# EAGLE design MiP_Proto-Pack (EAGLE 6.5.0)
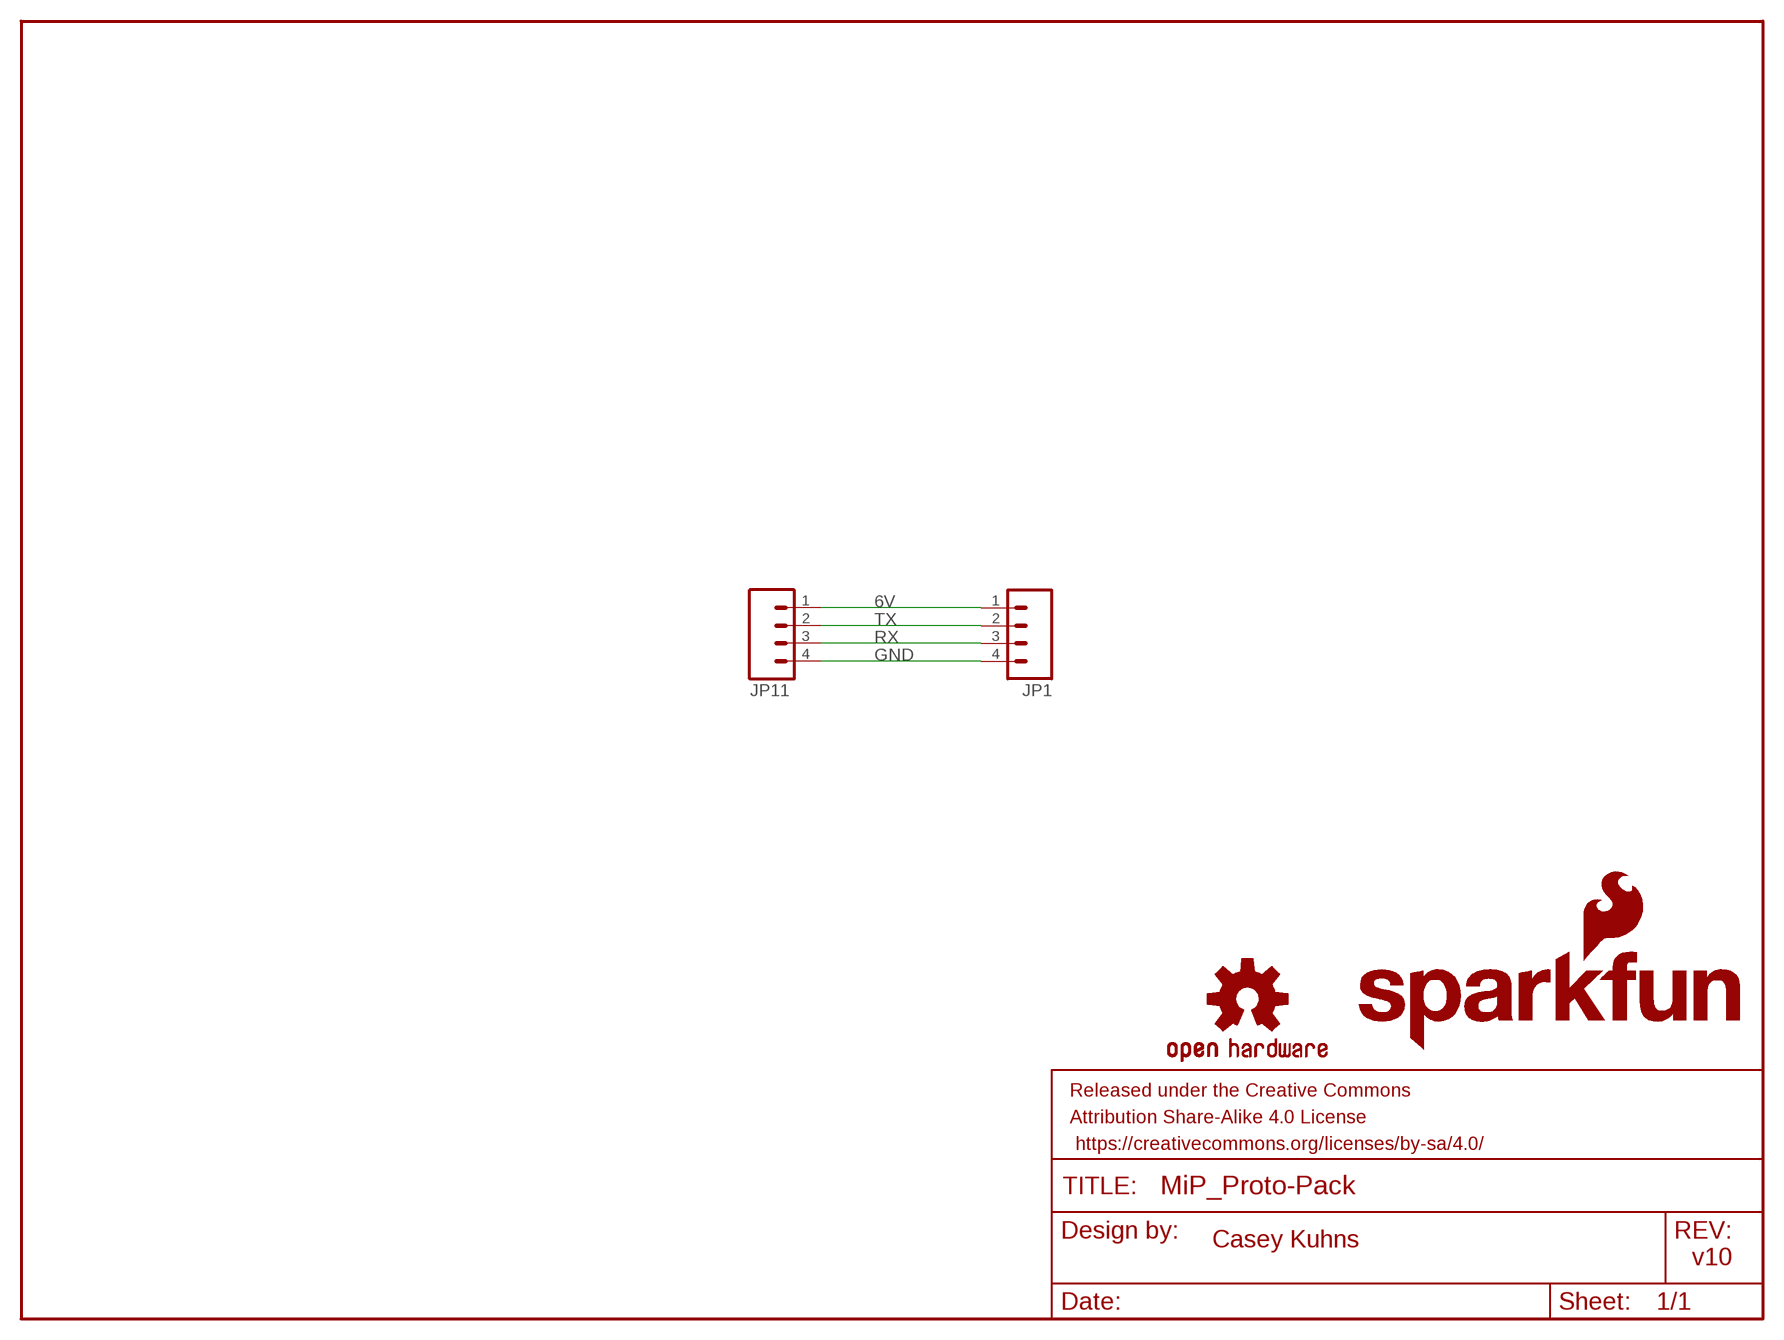
[diagram p0: schematic, sheet 1]

## Parts
FRAME1  FRAME-LETTER  [CREATIVE_COMMONS]
JP1  M04PTH  [1X04]
JP11  M04JST  [1X04-1.5MM_JST]
LOGO1  SFE_LOGO_NAME_FLAME.1_INCH  [SFE_LOGO_NAME_FLAME_.1]
LOGO2  OSHW-LOGOS  [OSHW-LOGO-S]

## Nets
6V: JP1.1 JP11.1
GND: JP1.4 JP11.4
RX: JP1.3 JP11.3
TX: JP1.2 JP11.2

## Notes on the sheet
- Casey Kuhns
- v10

## Library data of the parts
FRAME1 = SparkFun-Aesthetics:FRAME-LETTER: Schematic Frame Standard 8.5x11 US Letter frame
JP1 JP11 = SparkFun-Connectors:M04: Header 4 Standard 4-pin 0.1" header. Use with straight break away headers (SKU : PRT-00116), right angle break away headers (PRT-00553), swiss pins (PRT-00743), machine pins (PRT-00117), and female headers (PRT-00115). Molex polarized connector foot print use with SKU : PRT-08231 with associated crimp pins and housings. 1MM SMD Version SKU: PRT-10208
LOGO1 = SparkFun-Aesthetics:SFE_LOGO_NAME_FLAME: SFE Logo, name and flame This is the SparkFun full logo. The logo on the schematic will always be the same size; the package variant is the height of the flame part of the logo. Default layer for the logo on the board is tSilk.
LOGO2 = SparkFun-Aesthetics:OSHW-LOGO: Open Source Hardware Logo This logo indicates the piece of hardware it is found on incorporates a OSHW license and/or adheres to the definition of open source hardware found here: http://freedomdefined.org/OSHW

## Net classes
0 default: width 0.203 mm
1 vcc: width 0.254 mm

## Board
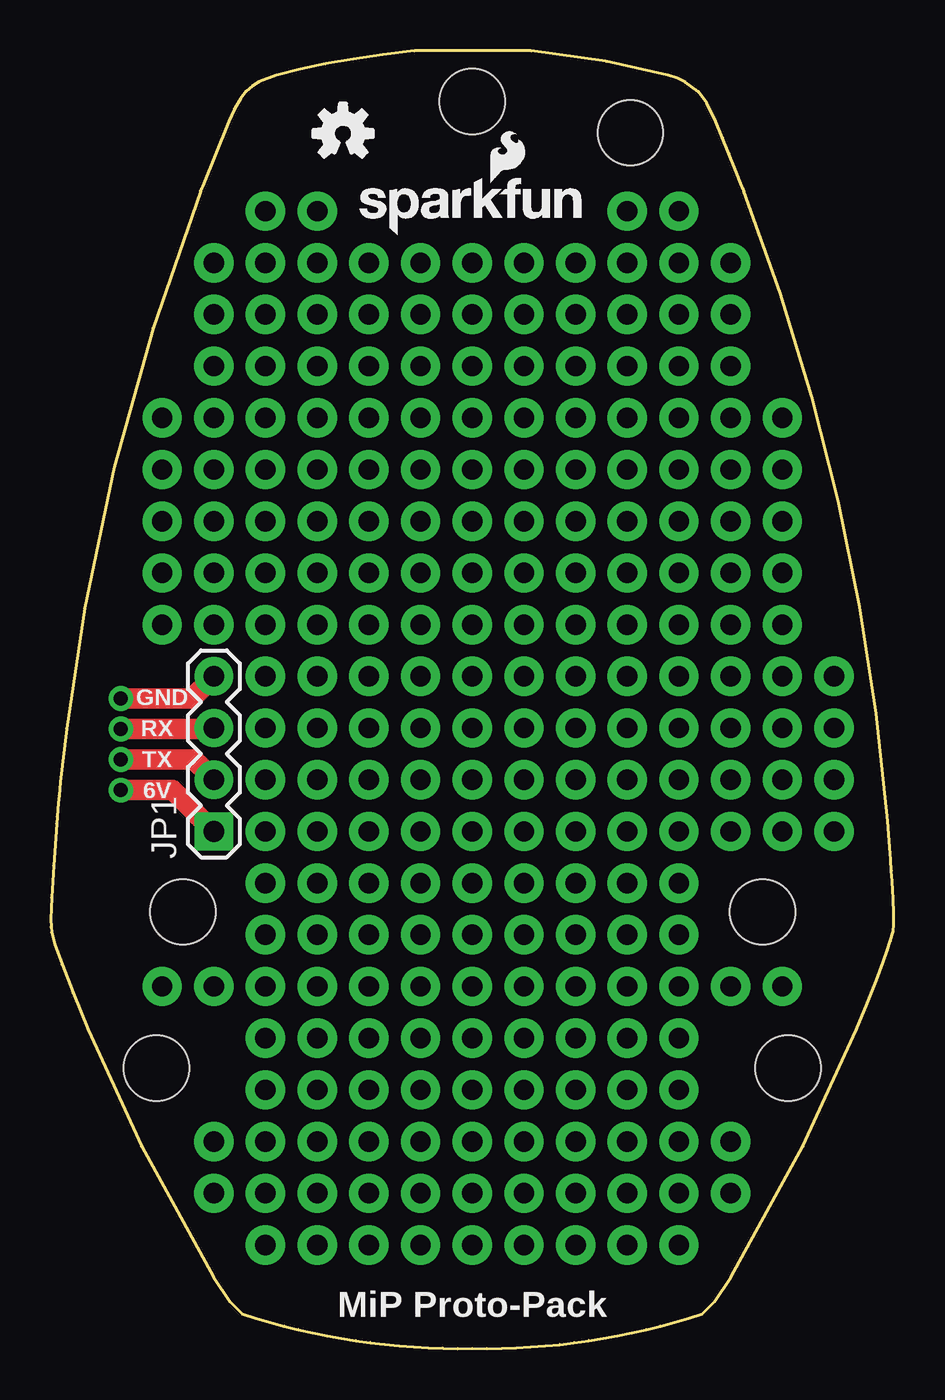
[diagram p1: board, top side]
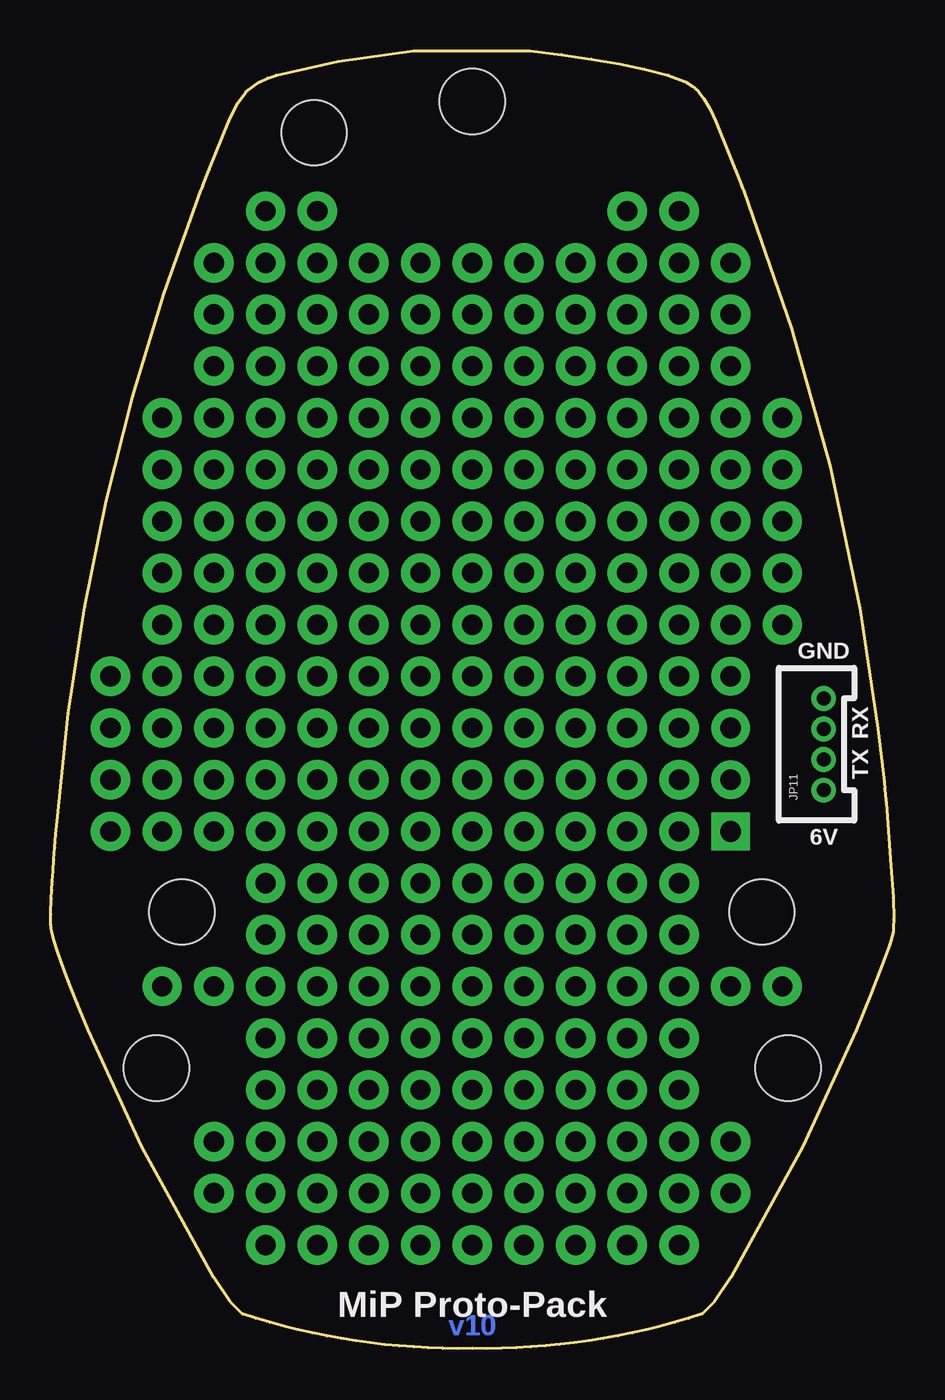
[diagram p2: board, bottom side, seen from below]

Size 41.42 x 63.77 mm. Coordinates in mm from the lower left corner, seen from the top.
Outline: 16.32,63.59 14.86,63.37 13.5,63.13 12.25,62.87 11.09,62.58 10.24,62.25 9.89,62.03 9.6,61.78 9.32,61.43 9.03,60.94 8.74,60.3 7.46,57.12 7.46,57.1 7.45,57.09 7.44,57.07 7.44,57.06 7.43,57.04 7.42,57.03 7.42,57.01 7.41,57 7.4,56.98 7.4,56.97 7.39,56.96 7.38,56.94 7.37,56.93 7.36,56.91 7.36,56.9 7.35,56.88 5.02,50.15 3.12,43.32 1.66,36.38 0.77,30.47 0.47,27.85 0.44,27.51 0.4,27.17 0.37,26.82 0.31,26.14 0.28,25.79 0.13,23.74 0.03,22.17 0,21.08 0.01,20.71 0.03,20.47 0.2,19.87 0.55,18.87 1.09,17.47 1.83,15.67 4.46,9.93 8.01,3.51 8.82,2.29 9.4,1.71 10.08,1.49 10.77,1.29 11.47,1.1 12.16,0.93 12.86,0.77 13.57,0.63 14.27,0.5 14.98,0.39 15.69,0.29 16.41,0.21 17.12,0.14 17.84,0.08 18.56,0.04 19.27,0.02 19.99,0 20.71,0.01 21.43,0 22.15,0.01 22.86,0.04 23.58,0.08 24.3,0.13 25.01,0.2 25.72,0.29 26.44,0.39 27.15,0.5 27.85,0.63 28.56,0.77 29.26,0.93 29.95,1.1 30.65,1.29 31.34,1.49 32.02,1.71 32.6,2.29 33.41,3.51 36.96,9.93 39.59,15.67 40.12,16.97 40.56,18.08 40.91,19 41.11,19.57 41.26,20.03 41.39,20.5 41.42,20.84 41.42,21.36 41.4,22.11 41.37,22.52 41.35,22.98 41.31,23.48 41.27,24.03 41.23,24.62 41.18,25.26 41.12,25.94 40.56,31.21 39.75,36.45 38.69,41.65 37.39,46.79 35.85,51.87 34.07,56.88 34.06,56.9 34.05,56.91 34.05,56.93 34.04,56.94 34.03,56.96 34.02,56.97 34.02,56.98 34.01,57 34,57.01 33.99,57.03 33.99,57.04 33.98,57.06 33.98,57.07 33.97,57.09 33.96,57.1 33.96,57.12 33.64,57.92 33.33,58.72 33.01,59.51 32.68,60.3 32.24,61.2 31.83,61.77 31.18,62.24 30.78,62.43 30.33,62.58 27.28,63.25 23.6,63.77 17.87,63.77 16.32,63.59
Copper layers (1*16): Top 0.035mm / dielectric 1.5mm / Bottom 0.035mm
Design rules "default *": minimum track width 6mil, minimum drill 13mil, track to track 6mil, track to pad 6mil, pad to pad 6mil, via to via 6mil, smd to smd 6mil, copper to edge 8mil, drill to drill 8mil, minimum pad ring 10mil, minimum via ring 8mil, stop-mask expansion 4mil, vias tented up to drill 25mil, thermal gap 8mil
Holes 3.2 mm at 20.71,61.28 28.48,59.76 34.98,21.45 5.19,13.78 36.23,13.78 6.48,21.45

### Footprints (pad centres in the part's own frame; a part is rotated, then mirrored left to right if it is on the bottom)
1X04 = drill 1.016 pad 1.88 square: 1 0,0 | drill 1.016 pad 1.88: 2 2.54,0; 3 5.08,0; 4 7.62,0
1X04-1.5MM_JST = drill 0.7: 1 0,0; 2 1.5,0; 3 3,0; 4 4.5,0

### Placement (x,y rotation side)
FRAME1  9.28,-10.14 0 top  (outside the outline)
JP1  8.01,25.42 90 top
JP11  3.44,27.45 90 bottom
LOGO1  14.74,54.63 0 top
LOGO2  14.36,59.71 0 top

### Tracks (layer width: path | path; a pad name or v marks a point on that pad's centre or on a via)
6V
  Top 1.016: JP11.1 5.98,27.45 JP1.1
GND
  Top 1.016: JP11.4 6.92,31.95 JP1.4
N$5  (via drill 1 pad 1.93)
  other vias: 10.55,33.04
N$6  (via drill 1 pad 1.93)
  other vias: 10.55,30.5
N$7  (via drill 1 pad 1.93)
  other vias: 10.55,27.96
N$8  (via drill 1 pad 1.93)
  other vias: 10.55,25.42
N$9  (via drill 1 pad 1.93)
  other vias: 10.55,22.88
N$10  (via drill 1 pad 1.93)
  other vias: 10.55,20.34
N$11  (via drill 1 pad 1.93)
  other vias: 13.09,20.34
N$12  (via drill 1 pad 1.93)
  other vias: 13.09,22.88
N$13  (via drill 1 pad 1.93)
  other vias: 13.09,25.42
N$15  (via drill 1 pad 1.93)
  other vias: 13.09,27.96
N$16  (via drill 1 pad 1.93)
  other vias: 13.09,30.5
N$17  (via drill 1 pad 1.93)
  other vias: 13.09,33.04
N$18  (via drill 1 pad 1.93)
  other vias: 13.09,35.58
N$19  (via drill 1 pad 1.93)
  other vias: 10.55,35.58
N$20  (via drill 1 pad 1.93)
  other vias: 8.01,35.58
N$21  (via drill 1 pad 1.93)
  other vias: 8.01,38.12
N$22  (via drill 1 pad 1.93)
  other vias: 10.55,38.12
N$23  (via drill 1 pad 1.93)
  other vias: 13.09,38.12
N$24  (via drill 1 pad 1.93)
  other vias: 15.63,38.12
N$25  (via drill 1 pad 1.93)
  other vias: 15.63,35.58
N$26  (via drill 1 pad 1.93)
  other vias: 15.63,33.04
N$27  (via drill 1 pad 1.93)
  other vias: 15.63,30.5
N$28  (via drill 1 pad 1.93)
  other vias: 15.63,27.96
N$29  (via drill 1 pad 1.93)
  other vias: 15.63,25.42
N$30  (via drill 1 pad 1.93)
  other vias: 15.63,22.88
N$31  (via drill 1 pad 1.93)
  other vias: 15.63,20.34
N$32  (via drill 1 pad 1.93)
  other vias: 20.71,20.34
N$33  (via drill 1 pad 1.93)
  other vias: 18.17,20.34
N$34  (via drill 1 pad 1.93)
  other vias: 18.17,22.88
N$35  (via drill 1 pad 1.93)
  other vias: 18.17,25.42
N$36  (via drill 1 pad 1.93)
  other vias: 18.17,27.96
N$37  (via drill 1 pad 1.93)
  other vias: 18.17,30.5
N$38  (via drill 1 pad 1.93)
  other vias: 18.17,33.04
N$39  (via drill 1 pad 1.93)
  other vias: 18.17,35.58
N$40  (via drill 1 pad 1.93)
  other vias: 18.17,38.12
N$41  (via drill 1 pad 1.93)
  other vias: 18.17,40.66
N$42  (via drill 1 pad 1.93)
  other vias: 15.63,40.66
N$43  (via drill 1 pad 1.93)
  other vias: 13.09,40.66
N$44  (via drill 1 pad 1.93)
  other vias: 10.55,40.66
N$45  (via drill 1 pad 1.93)
  other vias: 8.01,40.66
N$46  (via drill 1 pad 1.93)
  other vias: 5.47,40.66
N$47  (via drill 1 pad 1.93)
  other vias: 5.47,38.12
N$48  (via drill 1 pad 1.93)
  other vias: 5.47,35.58
N$49  (via drill 1 pad 1.93)
  other vias: 20.71,40.66
N$50  (via drill 1 pad 1.93)
  other vias: 20.71,35.58
N$51  (via drill 1 pad 1.93)
  other vias: 20.71,38.12
N$52  (via drill 1 pad 1.93)
  other vias: 20.71,33.04
N$53  (via drill 1 pad 1.93)
  other vias: 20.71,30.5
N$54  (via drill 1 pad 1.93)
  other vias: 20.71,27.96
N$55  (via drill 1 pad 1.93)
  other vias: 20.71,25.42
N$56  (via drill 1 pad 1.93)
  other vias: 20.71,22.88
N$57  (via drill 1 pad 1.93)
  other vias: 23.25,20.34
N$58  (via drill 1 pad 1.93)
  other vias: 23.25,22.88
N$59  (via drill 1 pad 1.93)
  other vias: 23.25,25.42
N$60  (via drill 1 pad 1.93)
  other vias: 23.25,27.96
N$61  (via drill 1 pad 1.93)
  other vias: 23.25,30.5
N$62  (via drill 1 pad 1.93)
  other vias: 23.25,35.58
N$63  (via drill 1 pad 1.93)
  other vias: 23.25,38.12
N$64  (via drill 1 pad 1.93)
  other vias: 23.25,40.66
N$65  (via drill 1 pad 1.93)
  other vias: 25.79,40.66
N$66  (via drill 1 pad 1.93)
  other vias: 25.79,38.12
N$67  (via drill 1 pad 1.93)
  other vias: 25.79,35.58
N$68  (via drill 1 pad 1.93)
  other vias: 23.25,33.04
N$69  (via drill 1 pad 1.93)
  other vias: 25.79,33.04
N$70  (via drill 1 pad 1.93)
  other vias: 25.79,30.5
N$71  (via drill 1 pad 1.93)
  other vias: 25.79,27.96
N$72  (via drill 1 pad 1.93)
  other vias: 25.79,25.42
N$73  (via drill 1 pad 1.93)
  other vias: 25.79,22.88
N$74  (via drill 1 pad 1.93)
  other vias: 25.79,20.34
N$75  (via drill 1 pad 1.93)
  other vias: 30.87,20.34
N$76  (via drill 1 pad 1.93)
  other vias: 28.33,20.34
N$77  (via drill 1 pad 1.93)
  other vias: 28.33,22.88
N$78  (via drill 1 pad 1.93)
  other vias: 28.33,25.42
N$79  (via drill 1 pad 1.93)
  other vias: 28.33,27.96
N$80  (via drill 1 pad 1.93)
  other vias: 28.33,30.5
N$81  (via drill 1 pad 1.93)
  other vias: 28.33,33.04
N$82  (via drill 1 pad 1.93)
  other vias: 28.33,35.58
N$83  (via drill 1 pad 1.93)
  other vias: 28.33,38.12
N$84  (via drill 1 pad 1.93)
  other vias: 28.33,40.66
N$85  (via drill 1 pad 1.93)
  other vias: 30.87,40.66
N$86  (via drill 1 pad 1.93)
  other vias: 30.87,38.12
N$87  (via drill 1 pad 1.93)
  other vias: 30.87,35.58
N$88  (via drill 1 pad 1.93)
  other vias: 30.87,30.5
N$89  (via drill 1 pad 1.93)
  other vias: 30.87,27.96
N$90  (via drill 1 pad 1.93)
  other vias: 30.87,25.42
N$91  (via drill 1 pad 1.93)
  other vias: 30.87,22.88
N$92  (via drill 1 pad 1.93)
  other vias: 30.87,33.04
N$93  (via drill 1 pad 1.93)
  other vias: 33.41,40.66
N$94  (via drill 1 pad 1.93)
  other vias: 33.41,38.12
N$95  (via drill 1 pad 1.93)
  other vias: 33.41,35.58
N$96  (via drill 1 pad 1.93)
  other vias: 33.41,33.04
N$97  (via drill 1 pad 1.93)
  other vias: 33.41,30.5
N$98  (via drill 1 pad 1.93)
  other vias: 33.41,27.96
N$99  (via drill 1 pad 1.93)
  other vias: 33.41,25.42
N$100  (via drill 1 pad 1.93)
  other vias: 35.95,25.42
N$101  (via drill 1 pad 1.93)
  other vias: 35.95,27.96
N$102  (via drill 1 pad 1.93)
  other vias: 35.95,30.5
N$103  (via drill 1 pad 1.93)
  other vias: 35.95,33.04
N$104  (via drill 1 pad 1.93)
  other vias: 35.95,35.58
N$105  (via drill 1 pad 1.93)
  other vias: 35.95,38.12
N$106  (via drill 1 pad 1.93)
  other vias: 35.95,40.66
N$107  (via drill 1 pad 1.93)
  other vias: 38.49,33.04
N$108  (via drill 1 pad 1.93)
  other vias: 38.49,30.5
N$109  (via drill 1 pad 1.93)
  other vias: 38.49,27.96
N$110  (via drill 1 pad 1.93)
  other vias: 38.49,25.42
N$111  (via drill 1 pad 1.93)
  other vias: 30.87,17.8
N$112  (via drill 1 pad 1.93)
  other vias: 30.87,15.26
N$113  (via drill 1 pad 1.93)
  other vias: 30.87,12.72
N$114  (via drill 1 pad 1.93)
  other vias: 30.87,10.18
N$115  (via drill 1 pad 1.93)
  other vias: 28.33,17.8
N$116  (via drill 1 pad 1.93)
  other vias: 23.25,17.8
N$117  (via drill 1 pad 1.93)
  other vias: 25.79,17.8
N$118  (via drill 1 pad 1.93)
  other vias: 20.71,17.8
N$119  (via drill 1 pad 1.93)
  other vias: 18.17,17.8
N$120  (via drill 1 pad 1.93)
  other vias: 15.63,17.8
N$121  (via drill 1 pad 1.93)
  other vias: 13.09,17.8
N$122  (via drill 1 pad 1.93)
  other vias: 10.55,17.8
N$123  (via drill 1 pad 1.93)
  other vias: 10.55,15.26
N$124  (via drill 1 pad 1.93)
  other vias: 10.55,12.72
N$125  (via drill 1 pad 1.93)
  other vias: 10.55,10.18
N$126  (via drill 1 pad 1.93)
  other vias: 13.09,10.18
N$127  (via drill 1 pad 1.93)
  other vias: 13.09,12.72
N$128  (via drill 1 pad 1.93)
  other vias: 13.09,15.26
N$129  (via drill 1 pad 1.93)
  other vias: 15.63,15.26
N$130  (via drill 1 pad 1.93)
  other vias: 20.71,15.26
N$131  (via drill 1 pad 1.93)
  other vias: 18.17,15.26
N$132  (via drill 1 pad 1.93)
  other vias: 23.25,15.26
N$133  (via drill 1 pad 1.93)
  other vias: 25.79,15.26
N$134  (via drill 1 pad 1.93)
  other vias: 28.33,15.26
N$135  (via drill 1 pad 1.93)
  other vias: 28.33,12.72
N$136  (via drill 1 pad 1.93)
  other vias: 25.79,12.72
N$137  (via drill 1 pad 1.93)
  other vias: 23.25,12.72
N$138  (via drill 1 pad 1.93)
  other vias: 20.71,12.72
N$139  (via drill 1 pad 1.93)
  other vias: 18.17,12.72
N$140  (via drill 1 pad 1.93)
  other vias: 15.63,12.72
N$141  (via drill 1 pad 1.93)
  other vias: 15.63,10.18
N$142  (via drill 1 pad 1.93)
  other vias: 20.71,10.18
N$143  (via drill 1 pad 1.93)
  other vias: 18.17,10.18
N$144  (via drill 1 pad 1.93)
  other vias: 23.25,10.18
N$145  (via drill 1 pad 1.93)
  other vias: 25.79,10.18
N$146  (via drill 1 pad 1.93)
  other vias: 28.33,10.18
N$147  (via drill 1 pad 1.93)
  other vias: 30.87,7.64
N$148  (via drill 1 pad 1.93)
  other vias: 30.87,5.1
N$149  (via drill 1 pad 1.93)
  other vias: 28.33,5.1
N$150  (via drill 1 pad 1.93)
  other vias: 25.79,5.1
N$151  (via drill 1 pad 1.93)
  other vias: 20.71,5.1
N$152  (via drill 1 pad 1.93)
  other vias: 15.63,5.1
N$153  (via drill 1 pad 1.93)
  other vias: 13.09,5.1
N$154  (via drill 1 pad 1.93)
  other vias: 10.55,5.1
N$155  (via drill 1 pad 1.93)
  other vias: 10.55,7.64
N$156  (via drill 1 pad 1.93)
  other vias: 13.09,7.64
N$157  (via drill 1 pad 1.93)
  other vias: 15.63,7.64
N$158  (via drill 1 pad 1.93)
  other vias: 18.17,7.64
N$159  (via drill 1 pad 1.93)
  other vias: 20.71,7.64
N$160  (via drill 1 pad 1.93)
  other vias: 23.25,7.64
N$161  (via drill 1 pad 1.93)
  other vias: 25.79,7.64
N$162  (via drill 1 pad 1.93)
  other vias: 28.33,7.64
N$163  (via drill 1 pad 1.93)
  other vias: 23.25,5.1
N$164  (via drill 1 pad 1.93)
  other vias: 18.17,5.1
N$165  (via drill 1 pad 1.93)
  other vias: 8.01,7.64
N$166  (via drill 1 pad 1.93)
  other vias: 8.01,10.18
N$167  (via drill 1 pad 1.93)
  other vias: 8.01,17.8
N$168  (via drill 1 pad 1.93)
  other vias: 33.41,17.8
N$169  (via drill 1 pad 1.93)
  other vias: 33.41,10.18
N$170  (via drill 1 pad 1.93)
  other vias: 33.41,7.64
N$177  (via drill 1 pad 1.93)
  other vias: 5.47,43.2
N$178  (via drill 1 pad 1.93)
  other vias: 8.01,43.2
N$179  (via drill 1 pad 1.93)
  other vias: 10.55,43.2
N$180  (via drill 1 pad 1.93)
  other vias: 13.09,43.2
N$181  (via drill 1 pad 1.93)
  other vias: 15.63,43.2
N$182  (via drill 1 pad 1.93)
  other vias: 18.17,43.2
N$183  (via drill 1 pad 1.93)
  other vias: 20.71,43.2
N$184  (via drill 1 pad 1.93)
  other vias: 23.25,43.2
N$185  (via drill 1 pad 1.93)
  other vias: 25.79,43.2
N$186  (via drill 1 pad 1.93)
  other vias: 28.33,43.2
N$187  (via drill 1 pad 1.93)
  other vias: 30.87,43.2
N$188  (via drill 1 pad 1.93)
  other vias: 33.41,43.2
N$189  (via drill 1 pad 1.93)
  other vias: 35.95,43.2
N$190  (via drill 1 pad 1.93)
  other vias: 35.95,45.74
N$191  (via drill 1 pad 1.93)
  other vias: 33.41,45.74
N$192  (via drill 1 pad 1.93)
  other vias: 30.87,45.74
N$193  (via drill 1 pad 1.93)
  other vias: 28.33,45.74
N$194  (via drill 1 pad 1.93)
  other vias: 25.79,45.74
N$195  (via drill 1 pad 1.93)
  other vias: 23.25,45.74
N$196  (via drill 1 pad 1.93)
  other vias: 20.71,45.74
N$197  (via drill 1 pad 1.93)
  other vias: 18.17,45.74
N$198  (via drill 1 pad 1.93)
  other vias: 15.63,45.74
N$199  (via drill 1 pad 1.93)
  other vias: 13.09,45.74
N$200  (via drill 1 pad 1.93)
  other vias: 10.55,45.74
N$201  (via drill 1 pad 1.93)
  other vias: 8.01,45.74
N$202  (via drill 1 pad 1.93)
  other vias: 5.47,45.74
N$203  (via drill 1 pad 1.93)
  other vias: 8.01,48.28
N$204  (via drill 1 pad 1.93)
  other vias: 10.55,48.28
N$205  (via drill 1 pad 1.93)
  other vias: 13.09,48.28
N$206  (via drill 1 pad 1.93)
  other vias: 15.63,48.28
N$207  (via drill 1 pad 1.93)
  other vias: 18.17,48.28
N$208  (via drill 1 pad 1.93)
  other vias: 20.71,48.28
N$209  (via drill 1 pad 1.93)
  other vias: 23.25,48.28
N$210  (via drill 1 pad 1.93)
  other vias: 25.79,48.28
N$211  (via drill 1 pad 1.93)
  other vias: 28.33,48.28
N$212  (via drill 1 pad 1.93)
  other vias: 30.87,48.28
N$213  (via drill 1 pad 1.93)
  other vias: 33.41,48.28
N$214  (via drill 1 pad 1.93)
  other vias: 33.41,50.82
N$215  (via drill 1 pad 1.93)
  other vias: 33.41,53.36
N$216  (via drill 1 pad 1.93)
  other vias: 30.87,50.82
N$217  (via drill 1 pad 1.93)
  other vias: 30.87,53.36
N$218  (via drill 1 pad 1.93)
  other vias: 28.33,53.36
N$219  (via drill 1 pad 1.93)
  other vias: 28.33,50.82
N$220  (via drill 1 pad 1.93)
  other vias: 25.79,50.82
N$221  (via drill 1 pad 1.93)
  other vias: 25.79,53.36
N$222  (via drill 1 pad 1.93)
  other vias: 23.25,53.36
N$223  (via drill 1 pad 1.93)
  other vias: 23.25,50.82
N$224  (via drill 1 pad 1.93)
  other vias: 20.71,50.82
N$225  (via drill 1 pad 1.93)
  other vias: 20.71,53.36
N$226  (via drill 1 pad 1.93)
  other vias: 18.17,53.36
N$227  (via drill 1 pad 1.93)
  other vias: 18.17,50.82
N$228  (via drill 1 pad 1.93)
  other vias: 15.63,50.82
N$229  (via drill 1 pad 1.93)
  other vias: 15.63,53.36
N$230  (via drill 1 pad 1.93)
  other vias: 13.09,53.36
N$231  (via drill 1 pad 1.93)
  other vias: 13.09,50.82
N$232  (via drill 1 pad 1.93)
  other vias: 10.55,50.82
N$233  (via drill 1 pad 1.93)
  other vias: 10.55,53.36
N$234  (via drill 1 pad 1.93)
  other vias: 8.01,53.36
N$235  (via drill 1 pad 1.93)
  other vias: 8.01,50.82
N$236  (via drill 1 pad 1.93)
  other vias: 10.55,55.9
N$239  (via drill 1 pad 1.93)
  other vias: 13.09,55.9
N$249  (via drill 1 pad 1.93)
  other vias: 28.33,55.9
N$250  (via drill 1 pad 1.93)
  other vias: 30.87,55.9
N$251  (via drill 1 pad 1.93)
  other vias: 35.95,17.8
N$252  (via drill 1 pad 1.93)
  other vias: 5.47,17.8
RX
  Top 1.016: JP11.3 7.96,30.45 JP1.3
TX
  Top 1.016: JP11.2 7.02,28.95 JP1.2

### Text on the board
Bottom: v10
tPlace: GND | RX | TX | 6V | MiP Proto-Pack
bPlace: GND | RX | TX | 6V | MiP Proto-Pack
tDocu: Casey Kuhns